# Altium schematic sheet LC-1.SchDoc
size A3
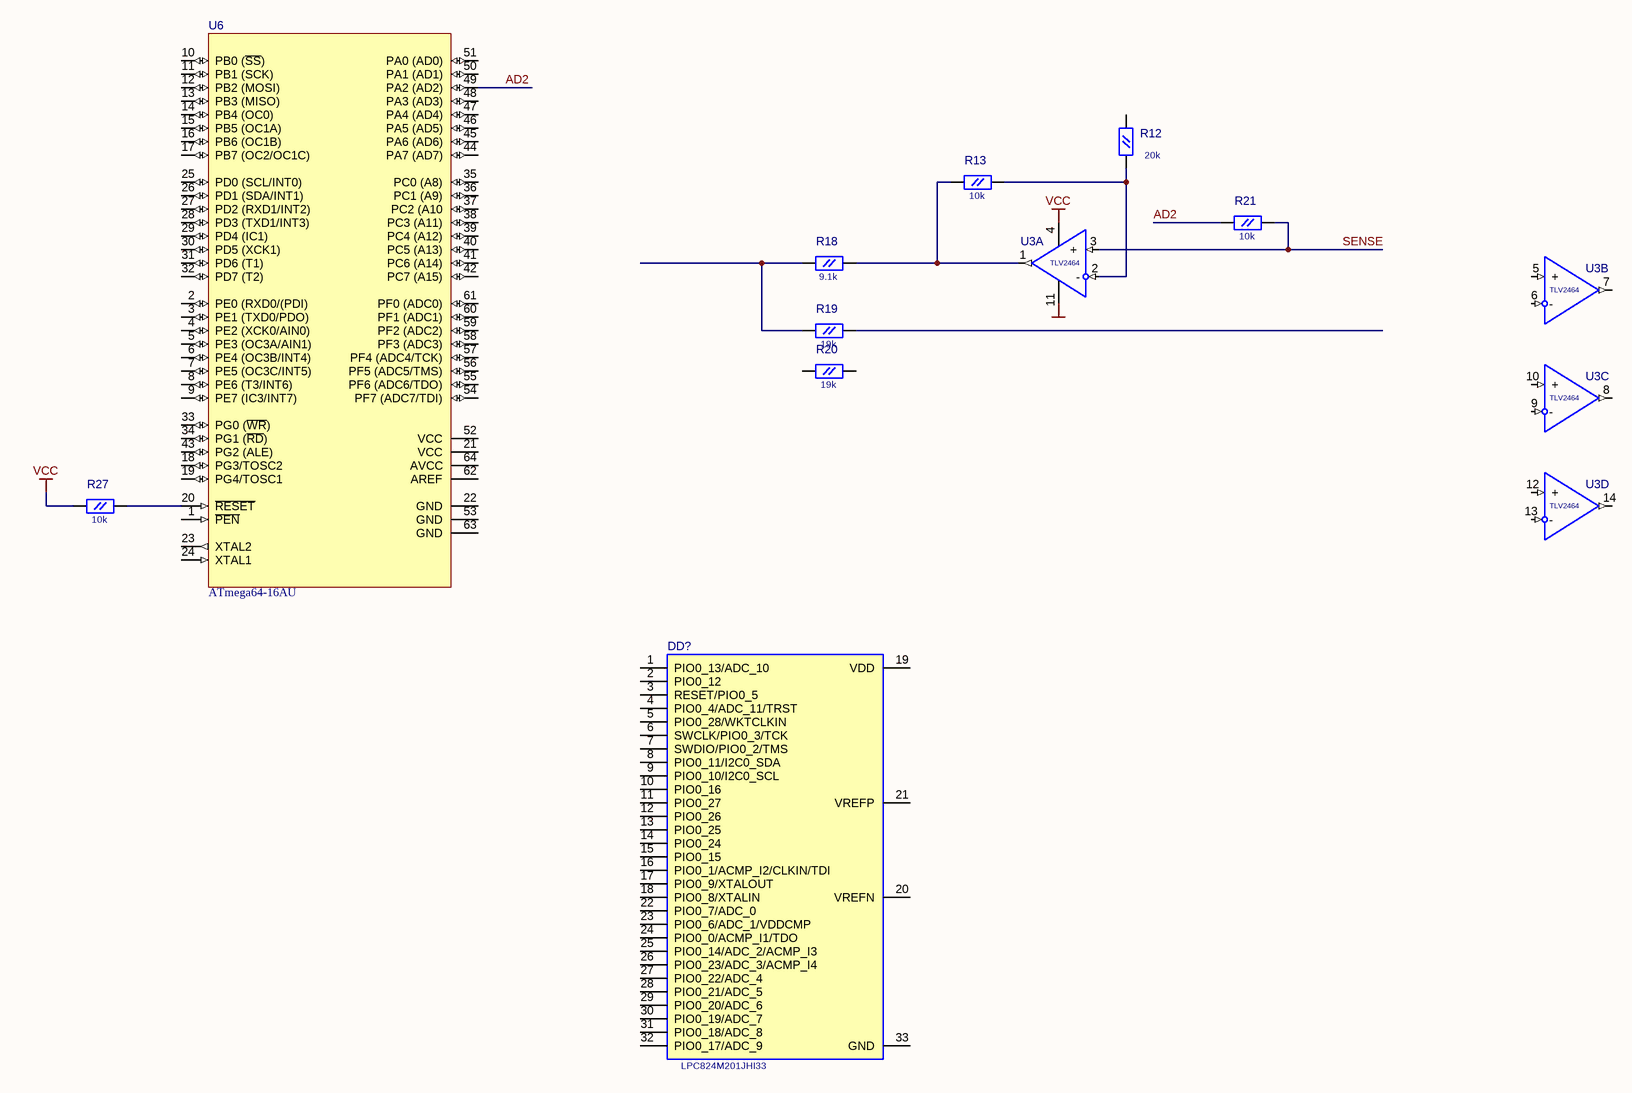
[diagram p0: LC-1.SchDoc]

## Parts
DD?  LPC824M201JHI33  [HVQFN33]
R12  value 20k  [R0805]  (hidden comment: RSMD)
R13  value 10k  [R0805]  (hidden comment: RSMD)
R18  value 9.1k  [R0805]  (hidden comment: RSMD)
R19  value 19k  [R0805]  (hidden comment: RSMD)
R20  value 19k  [R0805]  (hidden comment: RSMD)
R21  value 10k  [R0805]  (hidden comment: RSMD)
R27  value 10k  [R0805]  (hidden comment: RSMD)
U3  TLV2464  [SOIC 14]  (parts A,B,C,D of 4)
U6  ATmega64-16AU  [64A_N]

## Nets
GND: U3.11(V-)
VCC: R27.1(Pin1) U3.4(V+)
AD2: R21.1(Pin1) U6.49(PA2_(AD2))
SENSE: R21.2(Pin2) U3.3(+)
NetR12_1: R12.1(Pin1) R13.2(Pin2) U3.2(-)
NetR13_1: R13.1(Pin1) R18.2(Pin2) U3.1(OUT)
NetR18_1: R18.1(Pin1) R19.1(Pin1)
NetR27_2: R27.2(Pin2) U6.20(~{RESET})

Not connected (* = marked no-connect by the designer): DD? 1(PIO0_13/ADC_10) 2(PIO0_12) 3(RESET/PIO0_5) 4(PIO0_4/ADC_11/TRST) 5(PIO0_28/WKTCLKIN) 6(SWCLK/PIO0_3/TCK_) 7(SWDIO/PIO0_2/TMS) 8(PIO0_11/I2C0_SDA) 9(PIO0_10/I2C0_SCL) 10(PIO0_16) 11(PIO0_27) 12(PIO0_26) 13(PIO0_25) 14(PIO0_24) 15(PIO0_15) 16(PIO0_1/ACMP_I2/CLKIN/TDI) 17(PIO0_9/XTALOUT) 18(PIO0_8/XTALIN) 19(VDD) 20(VREFN) 21(VREFP) 22(PIO0_7/ADC_0) 23(PIO0_6/ADC_1/VDDCMP) 24(PIO0_0/ACMP_I1/TDO) 25(PIO0_14/ADC_2/ACMP_I3) 26(PIO0_23/ADC_3/ACMP_I4) 27(PIO0_22/ADC_4) 28(PIO0_21/ADC_5) 29(PIO0_20/ADC_6) 30(PIO0_19/ADC_7) 31(PIO0_18/ADC_8) 32(PIO0_17/ADC_9) 33(GND); R12 2(Pin2); R19 2(Pin2); R20 1(Pin1) 2(Pin2); U3 5(+) 6(-) 7(OUT) 8(OUT) 9(-) 10(+) 12(+) 13(-) 14(OUT); U6 1(~{PEN}) 2(PE0_(RXD0/(PDI)) 3(PE1_(TXD0/PDO)) 4(PE2_(XCK0/AIN0)) 5(PE3_(OC3A/AIN1)) 6(PE4_(OC3B/INT4)) 7(PE5_(OC3C/INT5)) 8(PE6_(T3/INT6)) 9(PE7_(IC3/INT7)) 10(PB0_(~{SS})) 11(PB1_(SCK)) 12(PB2_(MOSI)) 13(PB3_(MISO)) 14(PB4_(OC0)) 15(PB5_(OC1A)) 16(PB6_(OC1B)) 17(PB7_(OC2/OC1C)) 18(PG3/TOSC2) 19(PG4/TOSC1) 21(VCC) 22(GND) 23(XTAL2) 24(XTAL1) 25(PD0_(SCL/INT0)) 26(PD1_(SDA/INT1)) 27(PD2_(RXD1/INT2)) 28(PD3_(TXD1/INT3)) 29(PD4_(IC1)) 30(PD5_(XCK1)) 31(PD6_(T1)) 32(PD7_(T2)) 33(PG0_(~{WR})) 34(PG1_(~{RD})) 35(PC0_(A8)) 36(PC1_(A9)) 37(PC2_(A10) 38(PC3_(A11)) 39(PC4_(A12)) 40(PC5_(A13)) 41(PC6_(A14)) 42(PC7_(A15)) 43(PG2_(ALE)) 44(PA7_(AD7)) 45(PA6_(AD6)) 46(PA5_(AD5)) 47(PA4_(AD4)) 48(PA3_(AD3)) 50(PA1_(AD1)) 51(PA0_(AD0)) 52(VCC) 53(GND) 54(PF7_(ADC7/TDI)) 55(PF6_(ADC6/TDO)) 56(PF5_(ADC5/TMS)) 57(PF4_(ADC4/TCK)) 58(PF3_(ADC3)) 59(PF2_(ADC2)) 60(PF1_(ADC1)) 61(PF0_(ADC0)) 62(AREF) 63(GND) 64(AVCC)

## Notes on the sheet
- Title
- Date:
- Size
- A3
- Number
- Sheet
- of
- Revision
- File:
- Drawn By:

## Library data of the parts
R12 R13 R18-R21 R27 = RSMD: R0805; Part Field 1: *; Part Field 2: *
U3 = AD824: Value: *
U6 = ATmega64-16AU: 8-bit AVR Microcontroller, 4.5-5.5V, 64KB Flash, 2KB EEPROM, 4KB SRAM, 64-pin TQFP, Industrial Grade (-40°C to 85°C), Pb-Free; DatasheetVersion: revQ, Jul-2010; PackageVersion: revC, Oct-2010; PackageReference: 64A; PackageDescription: 64-Pin Plastic Thin Profile Quad Flat Pack, 14 x 14 x 1.0 mm Body, 0.8 mm Pitch (TQFP); Code_JEDEC: MS-026-AEB; ComponentLink1Description: Manufacturer URL; ComponentLink1URL: http://www.atmel.com/; ComponentLink2Description: ATmega64(L)  Datasheet; ComponentLink2URL: http://www.atmel.com/dyn/resources/prod_documents/doc2490.pdf; ComponentLink3Description: ATmega64(L) Summary; ComponentLink3URL: http://www.atmel.com/dyn/resources/prod_documents/2490S.pdf